# Altium schematic sheet Connectors.SchDoc
size 259 x 167 mm; SheetNumber: 7; SheetTotal: 7
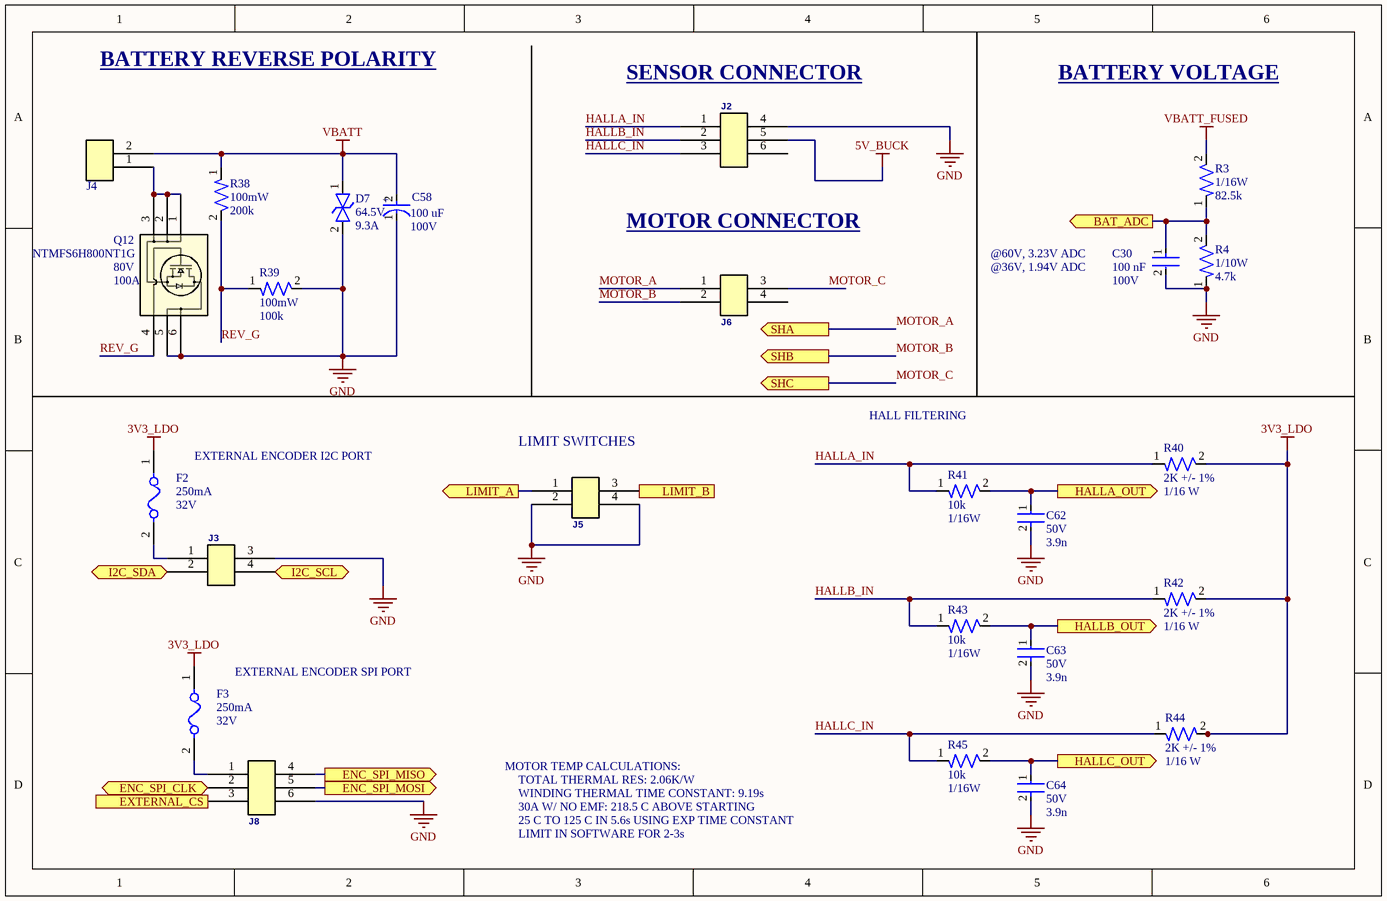
[diagram p0: Connectors.SchDoc]

## Parts
C30  Capacitance: 100 nF  Voltage: 100V  [CAP-0603]  (hidden comment: GRM188R72A104KA35D)
C58  Voltage: 100V  Capacitance: 100 uF  [CAP-100U-0001]  (hidden comment: EEETK2A101AM)
C62  Voltage: 50V  Capacitance: 3.9n  [CAP-0402]  (hidden comment: CC0402JRX7R9BB392)
C63  Voltage: 50V  Capacitance: 3.9n  [CAP-0402]  (hidden comment: CC0402JRX7R9BB392)
C64  Voltage: 50V  Capacitance: 3.9n  [CAP-0402]  (hidden comment: CC0402JRX7R9BB392)
D7  Voltage Rating: 64.5V  Current Rating: 9.3A  [DO-214AA (SMBJ)]  (hidden comment: SMBJ40CA)
F2  Fuse Current: 250mA  Voltage Rating: 32V  [RES-0603]  (hidden comment: 0467.250NRHF)
F3  Fuse Current: 250mA  Voltage Rating: 32V  [RES-0603]  (hidden comment: 0467.250NRHF)
J2  Molex 43045-0612  [CONN-6POS-0001]  (value not drawn)
J3  Molex 43045-0412  [CONN-4POS-0002]  (value not drawn)
J4  1546927-2  [CONN-1546927-2]  (value not drawn)
J5  Molex 43045-0412  [CONN-4POS-0002]  (value not drawn)
J6  Molex 43045-0412  [CONN-4POS-0002]  (value not drawn)
J8  Molex 43045-0612  [CONN-6POS-0001]  (value not drawn)
Q12  NTMFS6H800NT1G  Vdss: 80V  Drain Current: 100A  [DFN6_5X6_SO8FL_488AA_ONS]
R3  Power: 1/16W  Resistance: 82.5k  [RES-0402]  (hidden comment: RC0402FR-0782K5L)
R4  Power: 1/10W  Resistance: 4.7k  [RES-0603]  (hidden comment: RC0603FR-074K7L)
R38  Power: 100mW  Resistance: 200k  [RES-0603]  (hidden comment: RC0603FR-07200KL)
R39  Power: 100mW  Resistance: 100k  [RES-0603]  (hidden comment: RC0603FR-07100KL)
R40  Resistance: 2K +/- 1%  Power: 1/16 W  [RES-0402]  (hidden comment: RC0402FR-072KP)
R41  Resistance: 10k  Power: 1/16W  [RES-0402]  (hidden comment: RC0402FR-0710KL)
R42  Resistance: 2K +/- 1%  Power: 1/16 W  [RES-0402]  (hidden comment: RC0402FR-072KP)
R43  Resistance: 10k  Power: 1/16W  [RES-0402]  (hidden comment: RC0402FR-0710KL)
R44  Resistance: 2K +/- 1%  Power: 1/16 W  [RES-0402]  (hidden comment: RC0402FR-072KP)
R45  Resistance: 10k  Power: 1/16W  [RES-0402]  (hidden comment: RC0402FR-0710KL)

## Ports
BAT_ADC (out, see MCU[1B], MCU[3C]), ENC_SPI_CLK (bidir, see Encoder[2C], MCU[4B]), ENC_SPI_MISO (out, see Encoder[2C], MCU[1C]), ENC_SPI_MOSI (out, see Encoder[2C], MCU[1C]), EXTERNAL_CS (in, see MCU[1B]), HALLA_OUT (out, see MCU[1C], MCU[3C]), HALLB_OUT (out, see MCU[1D], MCU[3D]), HALLC_OUT (out, see MCU[1D], MCU[4D]), I2C_SCL (bidir, see MCU[4B]), I2C_SDA (bidir, see MCU[4B]), LIMIT_A (out, see MCU[4B]), LIMIT_B (out, see MCU[4B]), SHA (out, see Driver[4C], FETs[1B]), SHB (out, see Driver[4B], FETs[3B]), SHC (out, see Driver[4B], FETs[4B])

## Nets
3V3_LDO: F2.1 F3.1 R40.2 R42.2 R44.2
5V_BUCK: J2.5
GND: C30.2 C58.1 C62.2 C63.2 C64.2 D7.2 J2.4 J3.3 J5.2 J5.4 J8.6 Q12.5 Q12.6 R4.1 R39.2
VBATT: C58.2 D7.1 J4.2 R38.1
VBATT_FUSED: R3.2
BAT_ADC: C30.1 R3.1 R4.2 ; port BAT_ADC
ENC_SPI_CLK: J8.2 ; port ENC_SPI_CLK
ENC_SPI_MISO: J8.4 ; port ENC_SPI_MISO
ENC_SPI_MOSI: J8.5 ; port ENC_SPI_MOSI
EXTERNAL_CS: J8.3 ; port EXTERNAL_CS
HALLA_IN: J2.1 R40.1 R41.1
HALLA_OUT: C62.1 R41.2 ; port HALLA_OUT
HALLB_IN: J2.2 R42.1 R43.1
HALLB_OUT: C63.1 R43.2 ; port HALLB_OUT
HALLC_IN: J2.3 R44.1 R45.1
HALLC_OUT: C64.1 R45.2 ; port HALLC_OUT
I2C_SCL: J3.4 ; port I2C_SCL
I2C_SDA: J3.2 ; port I2C_SDA
LIMIT_A: J5.1 ; port LIMIT_A
LIMIT_B: J5.3 ; port LIMIT_B
MOTOR_A: J6.1 ; port SHA
MOTOR_B: J6.2 ; port SHB
MOTOR_C: J6.3 ; port SHC
REV_G: Q12.4 R38.2 R39.1
NetF2_2: F2.2 J3.1
NetF3_2: F3.2 J8.1
NetJ4_1: J4.1 Q12.1 Q12.2 Q12.3

Not connected (* = marked no-connect by the designer): J2 6; J6 4

## Notes on the sheet
- BATTERY REVERSE POLARITY
- (near J2) SENSOR CONNECTOR
- BATTERY VOLTAGE
- MOTOR CONNECTOR
- @60V, 3.23V ADC
- @36V, 1.94V ADC
- (near J5) LIMIT SWITCHES
- HALL FILTERING
- (near F2) EXTERNAL ENCODER I2C PORT
- (near F3) EXTERNAL ENCODER SPI PORT
- MOTOR TEMP CALCULATIONS:
- TOTAL THERMAL RES: 2.06K/W
- WINDING THERMAL TIME CONSTANT: 9.19s
- 30A W/ NO EMF: 218.5 C ABOVE STARTING
- 25 C TO 125 C IN 5.6s USING EXP TIME CONSTANT
- LIMIT IN SOFTWARE FOR 2-3s
- (in symbol CAP-100U-0001) +

## Library data of the parts
C30 = CAP-1U-0002: CAP CER 100NF 100V X7R 0603; Device Class: Ceramic; Size: 0603
C58 = CAP-100U-0001: CAP ALUM 100UF 20% 100V SMD; Device Class: Electrolytic; ComponentLink1Description: Datasheet; ComponentLink1URL: https://industrial.panasonic.com/cdbs/www-data/pdf/RDE0000/ABA0000C1190.pdf
C62-C64 = CAP-3.9N-0001: 3900 pF ±5% 50V Ceramic Capacitor X7R 0402 (1005 Metric)
D7 = DIO-TVS-0001: TVS DIODE 40VWM 64.5VC DO214AA; ComponentLink1Description: Datasheet; ComponentLink1URL: https://www.littelfuse.com/media?resourcetype=datasheets&itemid=09a6ae9a-73cb-4ac4-acac-e6dab92ab953&filename=littelfuse_tvs_diode_smbj_datasheet.pdf
F2 F3 = FUSE-0002: FUSE BRD MT 250MA 32VAC 32VDC; ComponentLink2Description: Datasheet; ComponentLink2URL: https://www.littelfuse.com/media?resourcetype=datasheets&itemid=4a59f034-1cca-460e-a5ba-e1e66247c76d&filename=littelfuse_fuse_467_datasheet.pdf
J2 J8 = CONN-6POS-0001: CONN HEADER VERT 6POS 3MM; ComponentLink1Description: Datasheet; ComponentLink1URL: https://tools.molex.com/pdm_docs/ps/PS-43045.pdf
J3 J5 J6 = CONN-4POS-0002: CONN HEADER VERT 4POS 3MM; ComponentLink1Description: Datasheet; ComponentLink1URL: https://www.molex.com/content/dam/molex/molex-dot-com/products/automated/en-us/salesdrawingpdf/430/43045/430450412_sd.pdf?inline
J4 = CONN-2POS-0003
Q12 = NTMFS6H800NT1G: N-Channel 80 V 28A (Ta), 203A (Tc) 3.8W (Ta), 200W (Tc) Surface Mount 5-DFN (5x6) (8-SOFL); Manufacturer_Part_Number: TPH2R506PL; Vgs (max): 20V; Vgs: 4V @ 1mA; RefDes: RefDes
R3 = RES-82.5k-0001: 82.5 kOhms ±1% 0.063W, 1/16W Chip Resistor 0402 (1005 Metric) Moisture Resistant Thick Film; Tolerance: 1%; Size: 0603; ComponentLink1Description: Datasheet; ComponentLink1URL: https://www.lcsc.com/datasheet/lcsc_datasheet_2304140030_YAGEO-RC0603FR-0712KL_C114659.pdf
R4 = RES-4.7k-0001: RES 4.7K OHM 1% 1/10W 0603; Tolerance: 1%; Size: 0603; ComponentLink1Description: Datasheet; ComponentLink1URL: https://www.yageo.com/upload/media/product/products/datasheet/rchip/PYu-RC_Group_51_RoHS_L_12.pdf
R38 = RES-200k-0001: RES SMD 200K OHM 1% 1/10W 0603; Tolerance: 1%; Size: 0603; ComponentLink1Description: Datasheet; ComponentLink1URL: https://www.yageo.com/upload/media/product/products/datasheet/rchip/PYu-RC_Group_51_RoHS_L_12.pdf
R39 = RES-100k-0001: RES SMD 100K OHM 1% 1/10W 0603; Tolerance: 1%; Size: 0603; ComponentLink1Description: Datasheet; ComponentLink1URL: https://www.yageo.com/upload/media/product/products/datasheet/rchip/PYu-RC_Group_51_RoHS_L_12.pdf
R40 R42 R44 = RES-2K-0001: 2 kOhms ±1% 0.063W, 1/16W Chip Resistor 0402 (1005 Metric) Thick Film
R41 R43 R45 = RES-10k-0001: RES 10K OHM 1% 1/16W 0402; Tolerance: 1%; Size: 0402; ComponentLink1Description: Datasheet; ComponentLink1URL: https://www.yageo.com/upload/media/product/products/datasheet/rchip/PYu-RC_Group_51_RoHS_L_12.pdf